# Altium schematic sheet MOTORS.SchDoc
size 199 x 219 mm; SheetNumber: 5; SheetTotal: 13
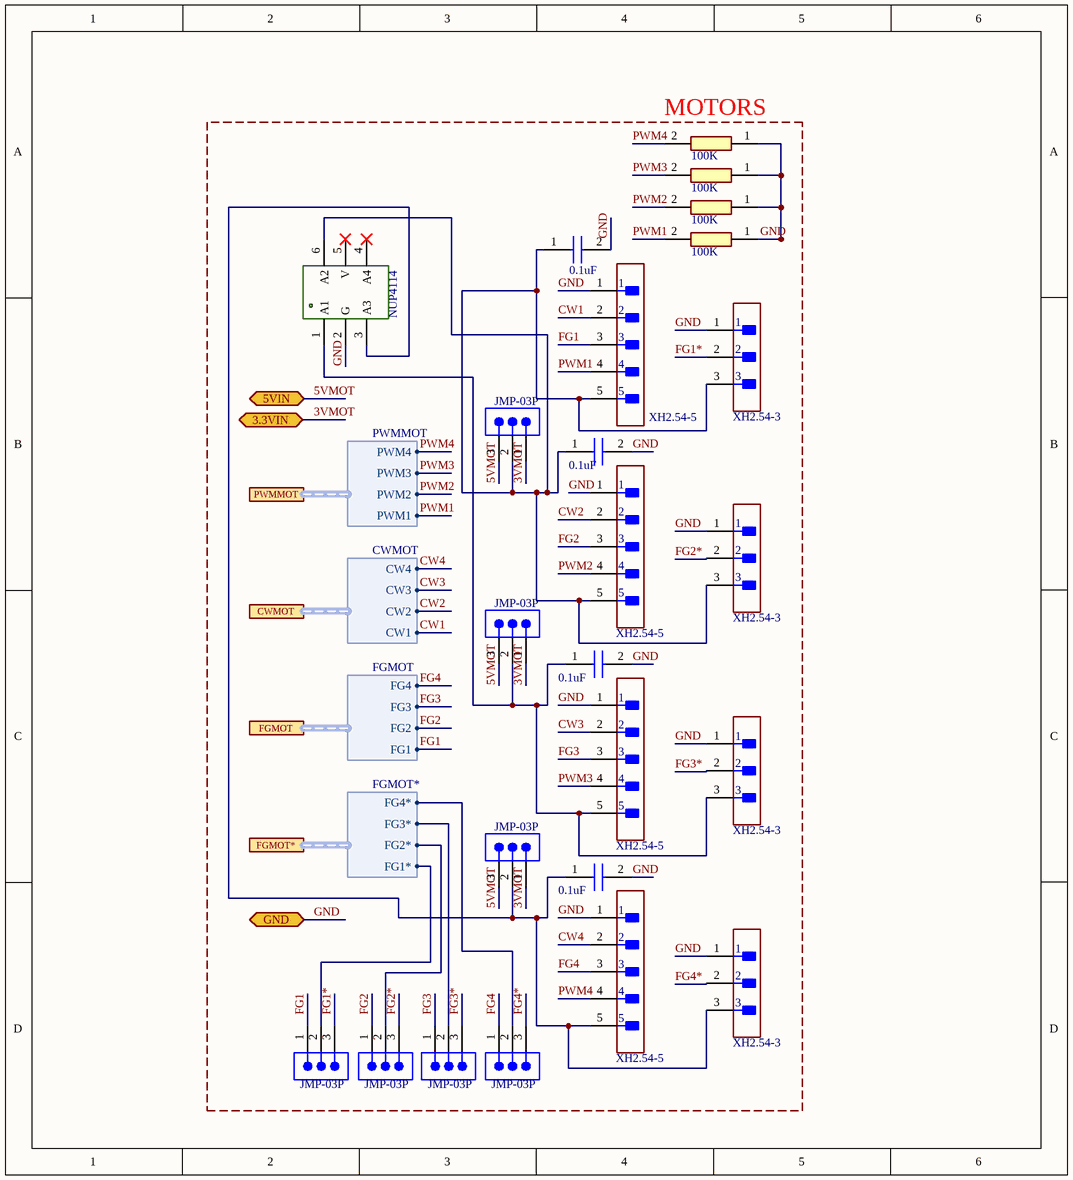
[diagram p0: MOTORS.SchDoc]

## Parts
CAPMOT1  0.1uF  [CAP0805]
CAPMOT2  0.1uF  [CAP0805]
CAPMOT3  0.1uF  [CAP0805]
CAPMOT4  0.1uF  [CAP0805]
JMPFG1  JMP-03P  [JMP-03P]
JMPFG2  JMP-03P  [JMP-03P]
JMPFG3  JMP-03P  [JMP-03P]
JMPFG4  JMP-03P  [JMP-03P]
JMPMOT2  JMP-03P  [JMP-03P]
JMPMOT3  JMP-03P  [JMP-03P]
JMPMOT4  JMP-03P  [JMP-03P]
NUPMOT  NUP4114  [NUP4114]
RESPWM1  100K  [RES0805]
RESPWM2  100K  [RES0805]
RESPWM3  100K  [RES0805]
RESPWM4  100K  [RES0805]
XH3MOT1  XH2.54-3  [XH2.54-3]
XH3MOT2  XH2.54-3  [XH2.54-3]
XH3MOT3  XH2.54-3  [XH2.54-3]
XH3MOT4  XH2.54-3  [XH2.54-3]
XH5MOT1  XH2.54-5  [XH2.54-5]
XH5MOT2  XH2.54-5  [XH2.54-5]
XH5MOT3  XH2.54-5  [XH2.54-5]
XH5MOT4  XH2.54-5  [XH2.54-5]

## Blocks framed on the sheet
MOTORS: CAPMOT1-CAPMOT4 JMPFG1-JMPFG4 JMPMOT2-JMPMOT4 NUPMOT RESPWM1-RESPWM4 XH3MOT1-XH3MOT4 XH5MOT1-XH5MOT4

## Ports
3.3VIN (bidir, see CONTROL_PCB_MAIN[5B], ADC1[2B], I2C[2A], I_O[1A], RELAY_5V_3.3V_LEVEL[3B], SPI[1A], UARTSTM[2A]), 5VIN (bidir, see CONTROL_PCB_MAIN[5B], ADC1[2B], I2C[2A], I_O[1A], LEDS[1A], RELAY_5V_3.3V_LEVEL[3B], SPI[1A], UARTSTM[2A]), CWMOT (harness CWMOT, see CONTROL_PCB_MAIN[5B], STM32[5C]), FGMOT (harness FGMOT, see CONTROL_PCB_MAIN[5B], STM32[5C]), FGMOT* (harness FGMOT*, see CONTROL_PCB_MAIN[5B], STM32[5C]), GND (bidir, see CONTROL_PCB_MAIN[5B], ADC1[2D], CAN[2C], I2C[2D], I_O[1C], LEDS[1D], RELAY_5V_3.3V_LEVEL[5C], RELAY_12VV_VDD_LEVEL[5B], SPI[1D], STM32[1D], UARTSTM[2D]), PWMMOT (harness PWMMOT, see CONTROL_PCB_MAIN[5B], STM32[5C])

## Harnesses
FGMOT: FG1, FG2, FG3, FG4
CWMOT: CW1, CW2, CW3, CW4
PWMMOT: PWM1, PWM2, PWM3, PWM4
FGMOT*: FG1*, FG2*, FG3*, FG4*

## Nets
3VMOT: JMPMOT2.1 JMPMOT3.1 JMPMOT4.1 ; port 3.3VIN
5VMOT: JMPMOT2.3 JMPMOT3.3 JMPMOT4.3 ; port 5VIN
CW1: XH5MOT1.2 ; port CWMOT.CW1
CW2: XH5MOT2.2 ; port CWMOT.CW2
CW3: XH5MOT3.2 ; port CWMOT.CW3
CW4: XH5MOT4.2 ; port CWMOT.CW4
FG1: JMPFG1.1 XH5MOT1.3 ; port FGMOT.FG1
FG1*: JMPFG1.3 XH3MOT1.2
FG2: JMPFG2.1 XH5MOT2.3 ; port FGMOT.FG2
FG2*: JMPFG2.3 XH3MOT2.2
FG3: JMPFG3.1 XH5MOT3.3 ; port FGMOT.FG3
FG3*: JMPFG3.3 XH3MOT3.2
FG4: JMPFG4.1 XH5MOT4.3 ; port FGMOT.FG4
FG4*: JMPFG4.3 XH3MOT4.2
GND: CAPMOT1.2 CAPMOT2.2 CAPMOT3.2 CAPMOT4.2 NUPMOT.2(G) RESPWM1.1 RESPWM2.1 RESPWM3.1 RESPWM4.1 XH3MOT1.1 XH3MOT2.1 XH3MOT3.1 XH3MOT4.1 XH5MOT1.1 XH5MOT2.1 XH5MOT3.1 XH5MOT4.1 ; port GND
PWM1: RESPWM2.2 XH5MOT1.4 ; port PWMMOT.PWM1
PWM2: RESPWM1.2 XH5MOT2.4 ; port PWMMOT.PWM2
PWM3: RESPWM3.2 XH5MOT3.4 ; port PWMMOT.PWM3
PWM4: RESPWM4.2 XH5MOT4.4 ; port PWMMOT.PWM4
NetCAPMOT1_1: CAPMOT1.1 CAPMOT2.1 JMPMOT2.2 NUPMOT.6(A2) XH3MOT1.3 XH3MOT2.3 XH5MOT1.5 XH5MOT2.5
NetCAPMOT3_1: CAPMOT3.1 JMPMOT3.2 NUPMOT.1(A1) XH3MOT3.3 XH5MOT3.5
NetCAPMOT4_1: CAPMOT4.1 JMPMOT4.2 NUPMOT.3(A3) XH3MOT4.3 XH5MOT4.5
NetJMPFG1_2: JMPFG1.2 ; port FGMOT*.FG1*
NetJMPFG2_2: JMPFG2.2 ; port FGMOT*.FG2*
NetJMPFG3_2: JMPFG3.2 ; port FGMOT*.FG3*
NetJMPFG4_2: JMPFG4.2 ; port FGMOT*.FG4*

Not connected (* = marked no-connect by the designer): NUPMOT 4(A4)* 5(V)*

## Library data of the parts
CAPMOT1-CAPMOT4 = CAP0805: CAP-SMD0805
JMPFG1-JMPFG4 JMPMOT2-JMPMOT4 = JMP-03P: PLS-1x3
NUPMOT = NUP4114: NUP4114HMR6T1G
RESPWM1-RESPWM4 = RES0805: RES-SMD0805
XH3MOT1-XH3MOT4 = XH2.54-3: JST XH2.54-3pin
XH5MOT1-XH5MOT4 = XH2.54-5: JST XH2.54-5pin